# Altium schematic sheet DIFF_DRV.SchDoc: ALICE FIT CFD Mezzanine
size 420 x 297 mm; CheckedBy: G.Kasprowicz; Author: INR Moscow; CompanyName: WUT ISE; DrawnBy: Maciej Podgóski; Organization: WUT ISE; Address1: PW ISE; Address2: Nowowiejska 15/19 00-665 Warsaw; Address3: gkasprow@gmail.com; DocumentNumber: 5; Revision: 2; SheetNumber: 5; SheetTotal: 5; ModifiedBy: -; CheckedDate: -; Title2: Differential driver; DivGrp: INR Moscow; Designer: INR Moscow; ModifiedDate: -; ProjectName: Sensor Box
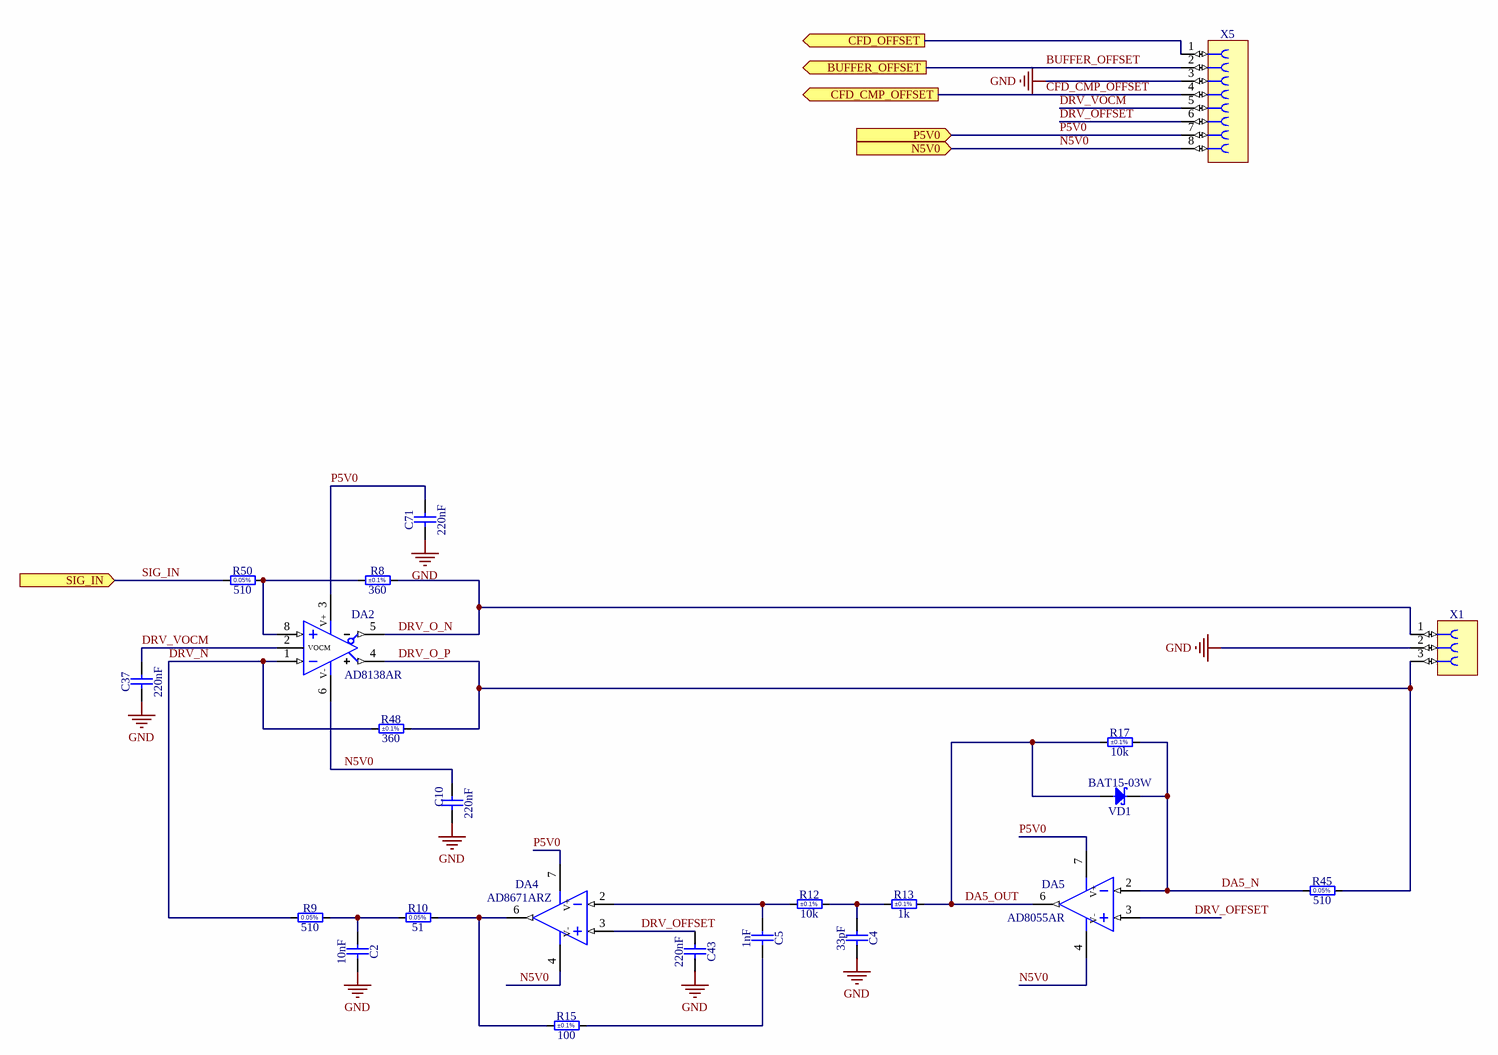
[diagram p0: DIFF_DRV.SchDoc]

## Parts
C2  10nF  [CAPC2012X135N]
C4  33pF  [CAPC2013X115N]
C5  1nF  [CAPC2013X100N]
C10  220nF  [CAPC2012X135N]
C37  220nF  [CAPC2012X135N]
C43  220nF  [CAPC2012X135N]
C71  220nF  [CAPC2012X135N]
DA2  AD8138AR  [SOIC127P600X175-8N]
DA4  AD8671ARZ  [SOIC127P600X175-8N]
DA5  AD8055AR  [SOIC127P600X175-8N]
R8  360  Tolerance: ±0.1%  [RESC2012X60N]
R9  510  [RESC1608X55N]
R10  51  [RESC2012X60N]
R12  10k  Tolerance: ±0.1%  [RESC2012X60N]
R13  1k  Tolerance: ±0.1%  [RESC2012X60N]
R15  100  Tolerance: ±0.1%  [RESC2012X60N]
R17  10k  Tolerance: ±0.1%  [RESC2012X60N]
R45  510  [RESC1608X55N]
R48  360  Tolerance: ±0.1%  [RESC2012X60N]
R50  510  [RESC1608X55N]
VD1  BAT15-03W  [SOD2512X110N]
X1  Socket 3  [SAMTEC_CES-103-01-T-S]  (value not drawn)
X5  Socket 8  [SAMTEC_CES-108-01-T-S]  (value not drawn)

## Ports
BUFFER_OFFSET (out), CFD_CMP_OFFSET (out), CFD_OFFSET (out), N5V0 (in), P5V0 (in), SIG_IN (in)

## Nets
GND: C2.1 C4.1 C10.1 C37.1 C43.1 C71.1 X1.2 X5.3
BUFFER_OFFSET: X5.2 ; port BUFFER_OFFSET
CFD_CMP_OFFSET: X5.4 ; port CFD_CMP_OFFSET
CFD_OFFSET: X5.1 ; port CFD_OFFSET
DA5_N: DA5.2(IN-) R17.1 R45.1 VD1.1(C)
DA5_OUT: DA5.6(OUT) R13.1 R17.2 VD1.2(A)
DRV_N: DA2.1(IN-) R9.2 R48.1
DRV_O_N: DA2.5(VOUT-) R8.2 X1.1
DRV_O_P: DA2.4(VOUT+) R45.2 R48.2 X1.3
DRV_OFFSET: C43.2 DA4.3(IN+) DA5.3(IN+) X5.6
DRV_VOCM: C37.2 DA2.2(VOCM) X5.5
N5V0: C10.2 DA2.6(V-) DA4.4(V-) DA5.4(V-) X5.8 ; port N5V0
P5V0: C71.2 DA2.3(V+) DA4.7(V+) DA5.7(V+) X5.7 ; port P5V0
SIG_IN: R50.1 ; port SIG_IN
NetC2_2: C2.2 R9.1 R10.2
NetC4_2: C4.2 R12.1 R13.2
NetC5_1: C5.1 R15.1
NetC5_2: C5.2 DA4.2(IN-) R12.2
NetDA2_8: DA2.8(IN+) R8.1 R50.2
NetDA4_6: DA4.6(OUT) R10.1 R15.2

## Notes on the sheet
- Project/Equipment
- Document
- Designer
- Drawn by
- Check.by
- Copyright WUT ISE 2024.
  This documentation describes Open Hardware and is licensed under the CERN OHL v.2. You may redistribute and modify this documentation under the terms of the CERN OHL v.2. (http://ohwr.org/CERNOHL). This documentation is distributed WITHOUT ANY EXPRESS OR IMPLIED WARRANTY, INCLUDING OF MERCHANTABILITY, SATISFACTORY QUALITY AND FITNESS FOR A PARTICULAR PURPOSE. Please see the CERN OHL v.2 for applicable conditions.
- Contact
- File
- Last Mod.
- Print Date
- Sheet
- Size
- A3
- of
- Rev
- (in symbol R0603_510R_0.1%_0.1W_10PPM) 0.05%
- (in symbol R0805_51R_0.05%_0.125W_10PPM) 0.05%

## Library data of the parts
C2 = CC0805_10NF_50V_2%_C0G: Non-polarised capacitor; Part Description: SMD Multilayer Chip Ceramic Capacitor; Manufacturer: GENERIC; Manufacturer1 Part Number: 0805N103G500CT; Voltage: 50V; TC: C0G/NP0; Tolerance: ±2%; Part Number: CC0805_10NF_50V_2%_C0G; Component Kind: Standard; Component Type: Standard; Pin Count: 2; Value: 10nF; Status: None; Manufacturer Part Number: CC0805_10NF_50V_2%_C0G; Case: 0805; Mounted: Yes; Socket: No; SMD: Yes; Sense: No; Manufacturer1 Example: Walsin Technology Corporation; Manufacturer1 ComponentHeight: 1.35mm; HelpURL: \\cern.ch\dfs\Applications\Altium\Datasheets\CC0805_C0G_Walsin.pdf; Author: CERN DEM HF; CreateDate: 15.04.2024; LatestRevisionDate: 15.04.2024
C4 = CC0805_33PF_200V_1%_NP0: Non-polarised capacitor; Part Description: SMD Multilayer Chip Ceramic Capacitor; Manufacturer: GENERIC; Manufacturer1 Part Number: KGQ21HCG2D330FT; Voltage: 200V; TC: C0G/NP0; Tolerance: ±1%; Part Number: CC0805_33PF_200V_1%_NP0; Component Kind: Standard; Component Type: Standard; Pin Count: 2; Value: 33pF; Status: None; Manufacturer Part Number: CC0805_33PF_200V_1%_NP0; Case: 0805; Mounted: Yes; Socket: No; SMD: Yes; Sense: No; Manufacturer1 Example: AVX; Manufacturer1 ComponentHeight: 1.15mm; HelpURL: \\cern.ch\dfs\Applications\Altium\Datasheets\CC0805_NP0_AVX_KGQ.pdf; Author: CERN DEM HF; CreateDate: 15.04.2024; LatestRevisionDate: 15.04.2024
C5 = CC0805_1NF_25V_1%_C0G: Non-polarised capacitor; Part Description: SMD Multilayer Chip Ceramic Capacitor; Manufacturer: GENERIC; Manufacturer1 Part Number: C0805C102F3GACTU; Voltage: 25V; TC: C0G/NP0; Tolerance: ±1%; Part Number: CC0805_1NF_25V_1%_C0G; Component Kind: Standard; Component Type: Standard; Pin Count: 2; Value: 1nF; Status: None; Manufacturer Part Number: CC0805_1NF_25V_1%_C0G; Case: 0805; Mounted: Yes; Socket: No; SMD: Yes; Sense: No; Manufacturer1 Example: KEMET; Manufacturer1 ComponentHeight: 0.88mm; HelpURL: \\cern.ch\dfs\Applications\Altium\Datasheets\CC0805_C0G_KEMET_(Commercial Grade).pdf; Author: CERN DEM JLC; CreateDate: 11.03.2015; LatestRevisionDate: 11.03.2015
C10 C37 C43 C71 = CC0805_220NF_50V_10%_X7R: Non-polarised capacitor; Part Description: SMD Multilayer Chip Ceramic Capacitor; Manufacturer: GENERIC; Manufacturer1 Part Number: GRM21BR71H224KA01L; Voltage: 50V; TC: X7R; Tolerance: ±10%; Part Number: CC0805_220NF_50V_10%_X7R; Component Kind: Standard; Component Type: Standard; Pin Count: 2; Value: 220nF; Status: Preferred; Manufacturer Part Number: CC0805_220NF_50V_10%_X7R; Case: 0805; Mounted: Yes; Socket: No; SMD: Yes; Sense: No; Manufacturer1 Example: MURATA; Manufacturer1 ComponentHeight: 1.35mm; HelpURL: \\cern.ch\dfs\Applications\Altium\Datasheets\CC0805_X7R_MURATA.pdf; Author: CERN DEM JLC; CreateDate: 03.12.2007; LatestRevisionDate: 03.12.2007
DA2 = AD8138AR: Differential Amplifier; Part Description: Low Distortion Differential ADC Driver; Manufacturer: ANALOG DEVICES; PressFit: No; Bonding: No; Part Number: AD8138AR; Component Kind: Standard; Component Type: Standard; Device: AD8138AR; PackageDescription: SOIC 8, Pitch 1.27mm - Body 4x5mm, IPC Medium Density; Status: Not recommended; Manufacturer Part Number: AD8138AR; Pin Count: 7; Case: SOIC8; Mounted: Yes; Socket: No; SMD: Yes; Sense: No; ComponentHeight: 1.75mm; Author: CERN DEM JLC; HelpURL: \\cern.ch\dfs\Applications\Altium\Datasheets\AD8138AR.pdf; CreateDate: 24.11.2008; LatestRevisionDate: 24.11.2008
DA4 = AD8671ARZ: Operational Amplifier; Part Description: Precision, Very Low Noise, Low Input Bias Current Operational Amplifier; Manufacturer: ANALOG DEVICES; PressFit: No; Bonding: No; Part Number: AD8671ARZ; Component Kind: Standard; Component Type: Standard; Device: AD8671ARZ; PackageDescription: SOIC 8, Pitch 1.27mm - Body 4x5mm, IPC Medium Density; Manufacturer Part Number: AD8671AR; Pin Count: 8; Case: SOIC8; Mounted: Yes; Socket: No; SMD: Yes; Sense: No; ComponentHeight: 1.75mm; Author: CERN DEM JLC; HelpURL: \\cern.ch\dfs\Applications\Altium\Datasheets\AD8671ARZ.pdf; CreateDate: 17.06.2014; LatestRevisionDate: 31.03.2022
DA5 = AD8055AR: Operational Amplifier; Part Description: Low Cost, 300 MHz Voltage Feedback Amplifier; Manufacturer: ANALOG DEVICES; PressFit: No; Bonding: No; Part Number: AD8055AR; Component Kind: Standard; Component Type: Standard; Device: AD8055AR; PackageDescription: SOIC 8, Pitch 1.27mm - Body 4x5mm, IPC Medium Density; Manufacturer Part Number: AD8055AR; Pin Count: 8; Case: SOIC8; Mounted: Yes; Socket: No; SMD: Yes; Sense: No; ComponentHeight: 1.75mm; Author: CERN DEM HF; HelpURL: \\cern.ch\dfs\Applications\Altium\Datasheets\AD8055.pdf; CreateDate: 15.04.2024; LatestRevisionDate: 15.04.2024
R8 R48 = R0805_360R_0.1%_0.125W_10PPM: Resistor - 0.1%; Part Description: Thin Film Chip Resistor; Manufacturer: GENERIC; Manufacturer1 Part Number: RT0805BRB07360RL; Power: 0.125W; TC: ±10ppm; PressFit: No; Part Number: R0805_360R_0.1%_0.125W_10PPM; Component Kind: Standard; Component Type: Standard; Pin Count: 2; Value: 360; Status: Not Recommended; Manufacturer Part Number: R0805_360R_0.1%_0.125W_10PPM; Case: 0805; Mounted: Yes; Sense: No; Socket: No; SMD: Yes; Manufacturer1 Example: YAGEO PHYCOMP; Manufacturer1 ComponentHeight: 0.6mm; HelpURL: \\cern.ch\dfs\Applications\Altium\Datasheets\R0805_YAGEO_RT.pdf; Author: CERN DEM HF; CreateDate: 11.07.2022; LatestRevisionDate: 11.07.2022
R9 R45 R50 = R0603_510R_0.1%_0.1W_10PPM: Resistor - 0.05%; Part Description: Thin Film Chip Resistor; Manufacturer: GENERIC; Manufacturer1 Part Number: RG1608N-511-W-T1; Power: 0.1W; TC: ±10ppm/°C; Tolerance: ±0.1%; PressFit: No; Part Number: R0603_510R_0.1%_0.1W_10PPM; Component Kind: Standard; Component Type: Standard; Pin Count: 2; Value: 510; Status: Not Recommended; Manufacturer Part Number: R0603_510R_0.1%_0.1W_10PPM; Case: 0805; Mounted: Yes; Sense: No; Socket: No; SMD: Yes; Manufacturer1 Example: SUSUMU; Manufacturer1 ComponentHeight: 0.5mm; HelpURL: \\cern.ch\dfs\Applications\Altium\Datasheets\R0603_SUSUMU_RG.pdf; Author: CERN DEM HF; CreateDate: 25.04.2024; LatestRevisionDate: 25.04.2024
R10 = R0805_51R_0.05%_0.125W_10PPM: Resistor - 0.05%; Part Description: Thin Film Chip Resistor; Manufacturer: GENERIC; Manufacturer1 Part Number: RG2012N-510-W-T1; Power: 0.1W; TC: ±10ppm/°C; Tolerance: ±0.1%; PressFit: No; Part Number: R0805_51R_0.05%_0.125W_10PPM; Component Kind: Standard; Component Type: Standard; Pin Count: 2; Value: 51; Status: Not Recommended; Manufacturer Part Number: R0805_51R_0.05%_0.125W_10PPM; Case: 0805; Mounted: Yes; Sense: No; Socket: No; SMD: Yes; Manufacturer1 Example: SUSUMU; Manufacturer1 ComponentHeight: 0.5mm; HelpURL: \\cern.ch\dfs\Applications\Altium\Datasheets\R0805_SUSUMU_RG.pdf; Author: CERN DEM HF; CreateDate: 25.04.2024; LatestRevisionDate: 25.04.2024
R12 R17 = R0805_10K_0.1%_0.1W_10PPM: Resistor - 0.1%; Part Description: Thin Film Chip Resistor; Manufacturer: GENERIC; Manufacturer1 Part Number: RN73C2A10KBTG; Power: 0.1W; TC: ±10ppm; PressFit: No; Part Number: R0805_10K_0.1%_0.1W_10PPM; Component Kind: Standard; Component Type: Standard; Pin Count: 2; Value: 10k; Status: Not Recommended; Manufacturer Part Number: R0805_10K_0.1%_0.1W_10PPM; Case: 0805; Mounted: Yes; Sense: No; Socket: No; SMD: Yes; Manufacturer1 Example: TYCO HOLSWORTHY; Manufacturer1 ComponentHeight: 0.6mm; HelpURL: \\cern.ch\dfs\Applications\Altium\Datasheets\R0805_Tyco_RN73.pdf; Author: CERN DEM JLC; CreateDate: 03.12.2007; LatestRevisionDate: 13.03.2008
R13 = R0805_1K_0.1%_0.1W_10PPM: Resistor - 0.1%; Part Description: Thin Film Chip Resistor; Manufacturer: GENERIC; Manufacturer1 Part Number: RN73C2A1K0BTG; Power: 0.1W; TC: ±10ppm; PressFit: No; Part Number: R0805_1K_0.1%_0.1W_10PPM; Component Kind: Standard; Component Type: Standard; Pin Count: 2; Value: 1k; Status: Not Recommended; Manufacturer Part Number: R0805_1K_0.1%_0.1W_10PPM; Case: 0805; Mounted: Yes; Sense: No; Socket: No; SMD: Yes; Manufacturer1 Example: TYCO HOLSWORTHY; Manufacturer1 ComponentHeight: 0.6mm; HelpURL: \\cern.ch\dfs\Applications\Altium\Datasheets\R0805_TYCO_RN73.pdf; Author: CERN DEM JLC; CreateDate: 28.05.2013; LatestRevisionDate: 28.05.2013
R15 = R0805_100R_0.1%_0.1W_10PPM: Resistor - 0.1%; Part Description: Thin Film Chip Resistor; Manufacturer: GENERIC; Manufacturer1 Part Number: RN73C2A100RBTG; Power: 0.1W; TC: ±10ppm; PressFit: No; Part Number: R0805_100R_0.1%_0.1W_10PPM; Component Kind: Standard; Component Type: Standard; Pin Count: 2; Value: 100; Status: Not Recommended; Manufacturer Part Number: R0805_100R_0.1%_0.1W_10PPM; Case: 0805; Mounted: Yes; Sense: No; Socket: No; SMD: Yes; Manufacturer1 Example: TYCO HOLSWORTHY; Manufacturer1 ComponentHeight: 0.6mm; HelpURL: \\cern.ch\dfs\Applications\Altium\Datasheets\R0805_Tyco_RN73.pdf; Author: CERN DEM JLC; CreateDate: 03.12.2007; LatestRevisionDate: 13.03.2008
VD1 = BAT15-03W: Schottky Diode; Part Description: Single Silicon RF Schottky Diode; Manufacturer: INFINEON; Device: BAT60A; Voltage: 4V; Power: 100mA; PressFit: No; Bonding: No; Part Number: BAT15-03W; Component Kind: Standard; Component Type: Standard; PackageDescription: Small Outline Diode (SOD-323), 1.70mm W X 1.25mm L X 1.10mm H body,  IPC Medium Density; Manufacturer Part Number: BAT15-03W; Pin Count: 2; Case: SOD-323; Mounted: Yes; Socket: No; SMD: Yes; Sense: No; ComponentHeight: 1.1mm; HelpURL: \\cern.ch\dfs\Applications\Altium\Datasheets\BAT15-03W.pdf; Author: CERN DEM HF; CreateDate: 15.04.2024; LatestRevisionDate: 15.04.2024
X1 = SAMTEC_CES-103-01-L-S: Connector 3 Female; Part Description: 3 Contacts, Pitch 2.54mm, Single Row Through Mount Straight Socket (Lead Length 3.25mm); Manufacturer: SAMTEC; PressFit: No; Part Number: SAMTEC_CES-103-01-L-S; Component Kind: Standard; Component Type: Standard; Pin Count: 3; Family: Socket 3; Mounted: Yes; Socket: No; SMD: No; Sense: No; Status: None; Manufacturer Part Number: CES-103-01-L-S; ComponentHeight: 5.08mm; HelpURL: \\cern.ch\dfs\Applications\Altium\Datasheets\SAMTEC_CES-103-01-T-S.pdf; Author: CERN DEM HF; CreateDate: 25.04.2024; LatestRevisionDate: 25.04.2024
X5 = SAMTEC_CES-108-01-L-S: Connector 8 Female; Part Description: 8 Contacts, Pitch 2.54mm, Single Row Through Mount Straight Socket (Lead Length 3.25mm); Manufacturer: SAMTEC; PressFit: No; Part Number: SAMTEC_CES-108-01-L-S; Component Kind: Standard; Component Type: Standard; Pin Count: 8; Family: Socket 8; Mounted: Yes; Socket: No; SMD: No; Sense: No; Status: None; Manufacturer Part Number: CES-108-01-L-S; ComponentHeight: 5.08mm; HelpURL: \\cern.ch\dfs\Applications\Altium\Datasheets\SAMTEC_CES-108-01-T-S.pdf; Author: CERN DEM HF; CreateDate: 25.04.2024; LatestRevisionDate: 25.04.2024